# Altium schematic sheet MCU_USB.SchDoc: Y1701
size A3; Date: 2018.11.13; Author: xianrui; CompanyName: 成都捷祥医疗器械有限公司; Revision: V1.0; SheetNumber: 6; SheetTotal: 6
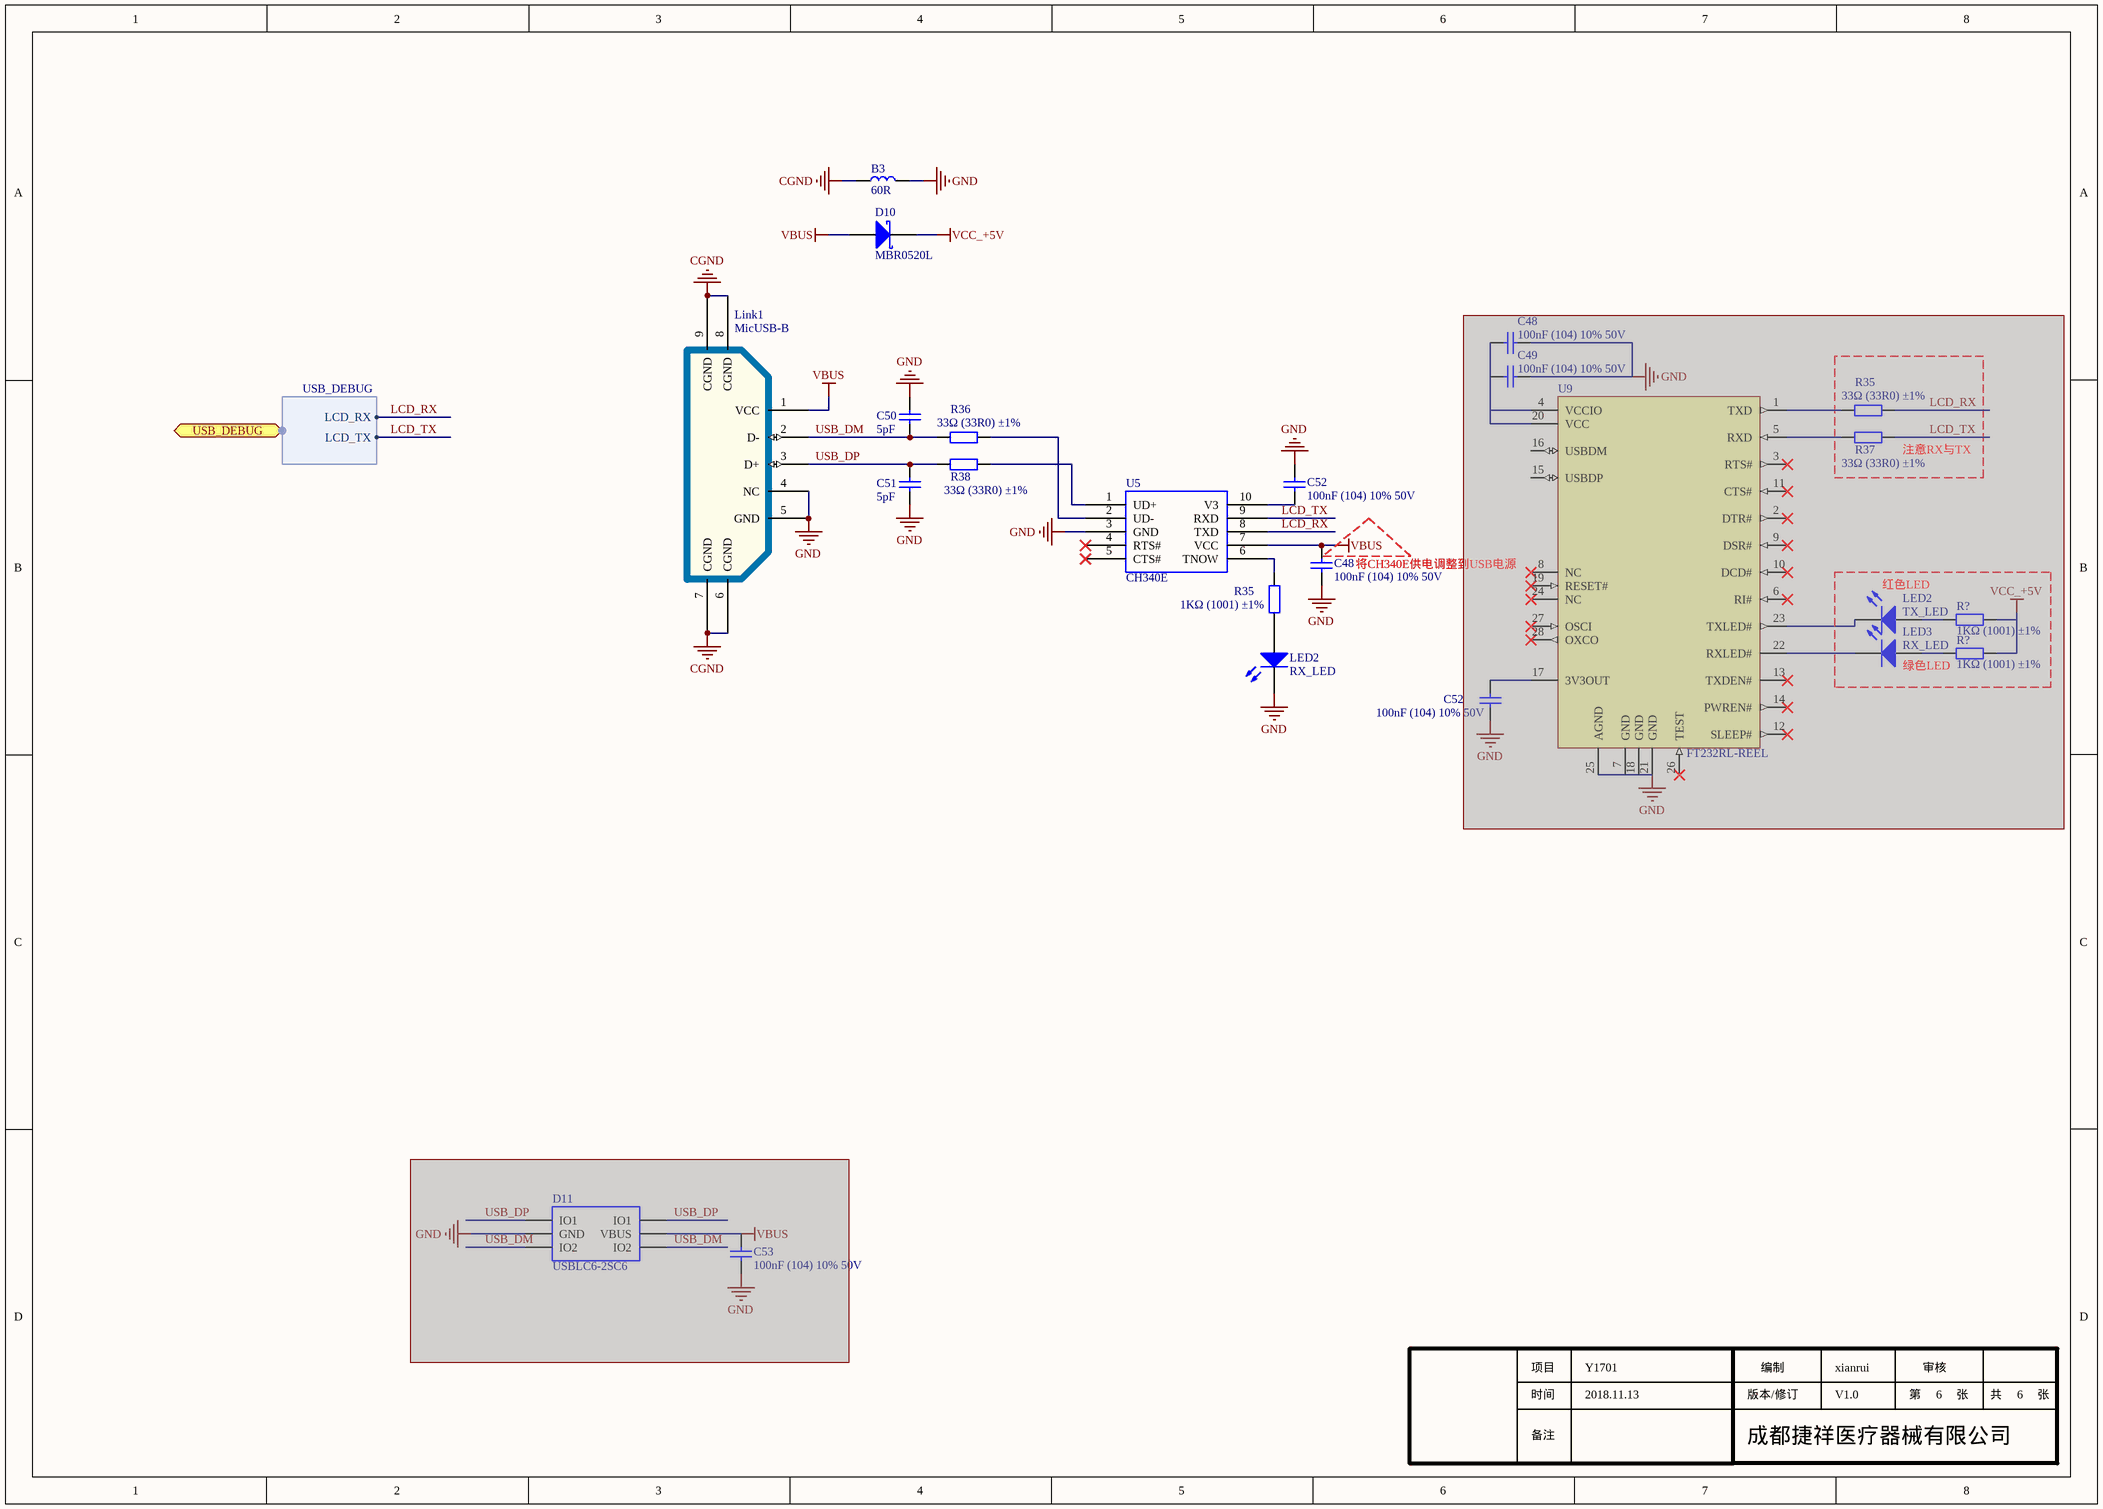
[diagram p0: MCU_USB.SchDoc]

## Parts
(Parts that share a designator on the sheet are numbered #1, #2 ... from top to bottom, then left to right.)
B3  60R  [LC-0805_L]
C48#1  100nF (104) 10% 50V  [LC-0603_C]  (masked out: inside a compile mask, not in the netlist)
C48#2  100nF (104) 10% 50V  [LC-0603_C]
C49  100nF (104) 10% 50V  [LC-0603_C]  (masked out: inside a compile mask, not in the netlist)
C50  5pF  [LC-0603_C]
C51  5pF  [LC-0603_C]
C52#1  100nF (104) 10% 50V  [LC-0603_C]
C52#2  100nF (104) 10% 50V  [LC-0603_C]  (masked out: inside a compile mask, not in the netlist)
C53  100nF (104) 10% 50V  [LC-0603_C]  (masked out: inside a compile mask, not in the netlist)
D10  MBR0520L  [RCD-SOD123]
D11  USBLC6-2SC6  [RCIC-SOT-23-6]  (masked out: inside a compile mask, not in the netlist)
LED2#1  TX_LED  [LC-0603_LED_S1]  (masked out: inside a compile mask, not in the netlist)
LED2#2  RX_LED  [LC-0603_LED_S1]
LED3  RX_LED  [LC-0603_LED_S1]  (masked out: inside a compile mask, not in the netlist)
Link1  MicUSB-B  [RCJ-MICRO-USB-B]
R35#1  33Ω (33R0) ±1%  [LC-0603_R]  (masked out: inside a compile mask, not in the netlist)
R35#2  1KΩ (1001) ±1%  [LC-0603_R]
R36  33Ω (33R0) ±1%  [LC-0603_R]
R37  33Ω (33R0) ±1%  [LC-0603_R]  (masked out: inside a compile mask, not in the netlist)
R38  33Ω (33R0) ±1%  [LC-0603_R]
R?#1  1KΩ (1001) ±1%  [LC-0603_R]  (masked out: inside a compile mask, not in the netlist)
R?#2  1KΩ (1001) ±1%  [LC-0603_R]  (masked out: inside a compile mask, not in the netlist)
U5  CH340E  [RCIC-MSOP10-1]
U9  FT232RL-REEL  [LC-SSOP-28_208mil]  (masked out: inside a compile mask, not in the netlist)

## Blocks framed on the sheet
注意RX与TX: R35#1 R37

## Ports
USB_DEBUG (harness USB_DEBUG)

## Harnesses
USB_DEBUG: LCD_RX, LCD_TX

## Nets
CGND: B3.1 Link1.6(CGND) Link1.7(CGND) Link1.8(CGND) Link1.9(CGND)
GND: B3.2 C48#2.2 C50.2 C51.1 C52#1.2 LED2#2.K Link1.4(NC) Link1.5(GND) U5.3(GND)
VBUS: C48#2.1 D10.1(A) Link1.1(VCC) U5.7(VCC)
VCC_+5V: D10.2(K)
LCD_RX: U5.8(TXD) ; port USB_DEBUG.LCD_RX
LCD_TX: U5.9(RXD) ; port USB_DEBUG.LCD_TX
USB_DM: C50.1 Link1.2(D-) R36.1
USB_DP: C51.2 Link1.3(D+) R38.1
NetC52#1_1: C52#1.1 U5.10(V3)
NetLED2#2_A: LED2#2.A R35#2.1
NetR35#2_2: R35#2.2 U5.6(TNOW)
NetR36_2: R36.2 U5.2(UD-)
NetR38_2: R38.2 U5.1(UD+)

Not connected (* = marked no-connect by the designer): U5 4(RTS#)* 5(CTS#)*

## Notes on the sheet
- (near C48#2) 将CH340E供电调整到USB电源
- (near LED2#1) 红色LED
- (near LED3) 绿色LED
- 项目
- 时间
- 版本/修订
- 编制
- 第
- 审核
- 张
- 共
- 备注

## Library data of the parts
B3 = Bead: Bead,1400mA; Manufacture: muRata(村田); Ordering: BLM21PG221SN1; Comments: 60R; Libnum: *; LC: http://item.szlcsc.com/87016.html; LC Supplier Part Number: C85840
C48#1 C48#2 C49 C52#1 C52#2 C53 = 0603 100nF (104) 10% 50V: 贴片电容; ComponentLink1Description: 供应商链接; ComponentLink1URL: http://www.szlcsc.com/product/details_15331.html; Package: 0603; Supplier: LC; SuppliersPartNumber: C14663
C50 C51 = Cap: Capacitor; Value: 100pF; Published: 8-Jun-2000; LatestRevisionDate: 17-Jul-2002; LatestRevisionNote: Re-released for DXP Platform.; PackageReference: RAD-0.3; Publisher: Altium Limited
D10 = DiodeC: Schottky Diode; Comments: MBR0520L; Libnum: *; Manufacture: *; Ordering: MBR0520L
D11 = USBLC6-2: low capacitance ESD protection; Manufacture: ST(意法半导体); Lib: *; Comments: USBLC6-2SC6; Ordering: USBLC6-2SC6; LC: http://item.szlcsc.com/7996.html; LC Supplier Part Number: C7519
LED2#1 LED2#2 LED3 = LEDA: Libnum: *; Manufacture: *; Odering: *
  LED2#1: Comments: TX_LED
  LED2#2 LED3: Comments: RX_LED
Link1 = MicUSB_B: Micro USB-B型接口; Manufacture: 硕方电子; MPN: *
R35#1 R36-R38 = 0603 33Ω (33R0) 1%: 贴片电阻; ComponentLink1Description: 供应商链接; ComponentLink1URL: http://www.szlcsc.com/product/details_23867.html; Package: 0603; Supplier: LC; SuppliersPartNumber: C23140
R35#2 R?#1 R?#2 = 0603 1KΩ (1001) 1%: 贴片电阻; ComponentLink1Description: 供应商链接; ComponentLink1URL: http://www.szlcsc.com/product/details_21904.html; Package: 0603; Supplier: LC; SuppliersPartNumber: C21190
U5 = CH340E: USB TO UART; Manufacture: WCH(南京沁恒); Comments: CH340E; Libnum: *; Ordering: CH340E
U9 = FT232RL-REEL: USB; ComponentLink1Description: 供应商链接; ComponentLink1URL: http://www.szlcsc.com/product/details_9194.html; Package: SSOP-28_208mil; Supplier: LC; SuppliersPartNumber: C8690